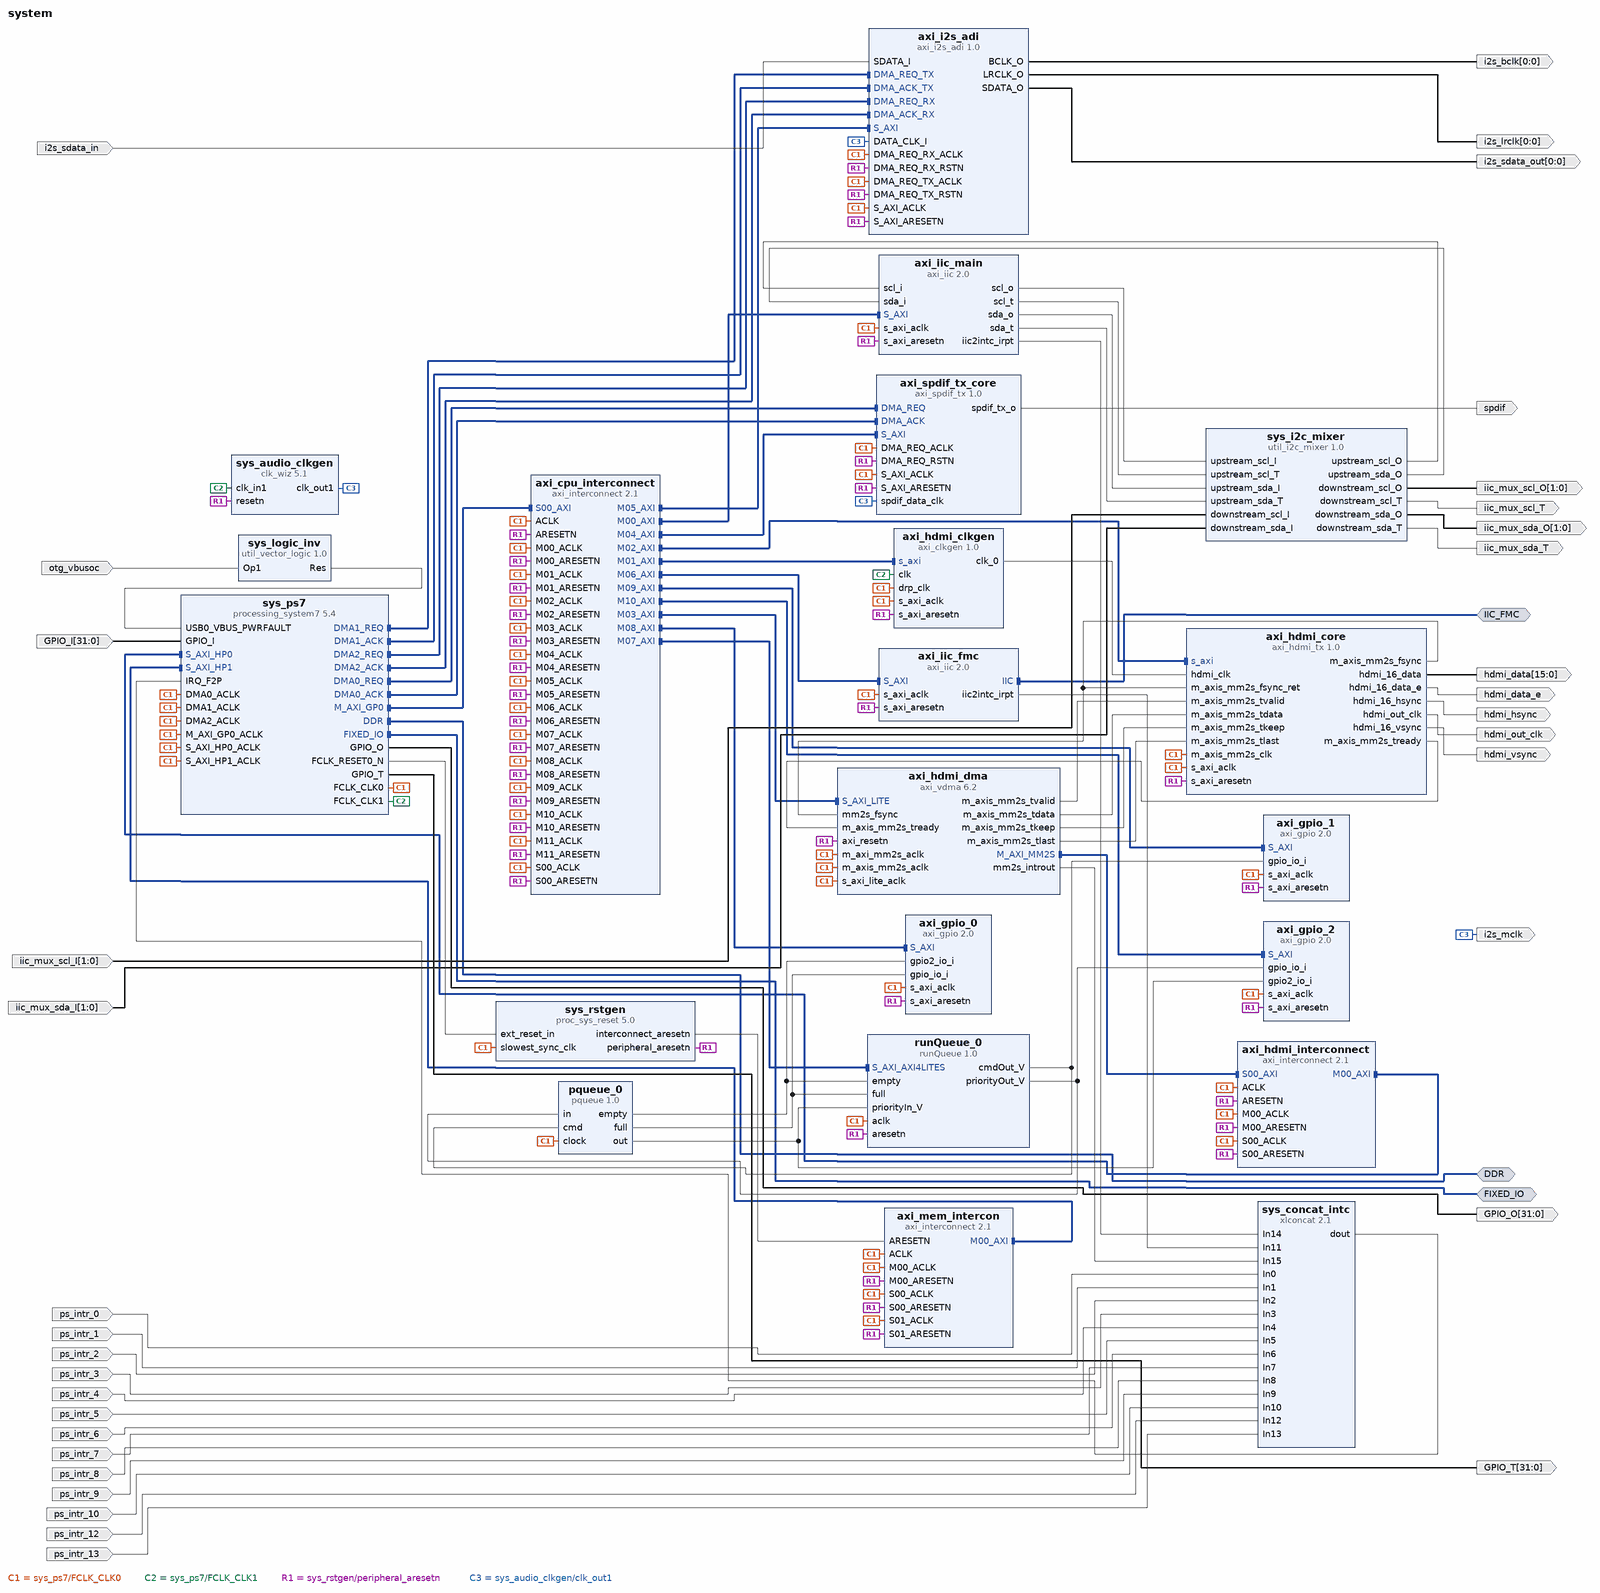
[diagram p0: block diagram of the top level]
# Vivado block design system, Vivado 2014.2
create_bd_design system

create_bd_intf_port -mode Master -vlnv xilinx.com:interface:ddrx_rtl:1.0 DDR
create_bd_intf_port -mode Master -vlnv xilinx.com:display_processing_system7:fixedio_rtl:1.0 FIXED_IO
create_bd_intf_port -mode Master -vlnv xilinx.com:interface:iic_rtl:1.0 IIC_FMC
create_bd_port -dir I -from 31 -to 0 GPIO_I
create_bd_port -dir O -from 31 -to 0 GPIO_O
create_bd_port -dir O -from 31 -to 0 GPIO_T
create_bd_port -dir I -from 1 -to 0 iic_mux_scl_I
create_bd_port -dir O -from 1 -to 0 iic_mux_scl_O
create_bd_port -dir O iic_mux_scl_T
create_bd_port -dir I -from 1 -to 0 iic_mux_sda_I
create_bd_port -dir O -from 1 -to 0 iic_mux_sda_O
create_bd_port -dir O iic_mux_sda_T
create_bd_port -dir I otg_vbusoc
create_bd_port -dir O hdmi_out_clk
create_bd_port -dir O hdmi_hsync
create_bd_port -dir O hdmi_vsync
create_bd_port -dir O hdmi_data_e
create_bd_port -dir O -from 15 -to 0 hdmi_data
create_bd_port -dir O -type clk i2s_mclk
create_bd_port -dir O spdif
create_bd_port -dir O -from 0 -to 0 i2s_bclk
create_bd_port -dir O -from 0 -to 0 i2s_lrclk
create_bd_port -dir O -from 0 -to 0 i2s_sdata_out
create_bd_port -dir I i2s_sdata_in
create_bd_port -dir I ps_intr_0
create_bd_port -dir I ps_intr_1
create_bd_port -dir I ps_intr_2
create_bd_port -dir I ps_intr_3
create_bd_port -dir I ps_intr_4
create_bd_port -dir I ps_intr_5
create_bd_port -dir I ps_intr_6
create_bd_port -dir I ps_intr_7
create_bd_port -dir I ps_intr_8
create_bd_port -dir I ps_intr_9
create_bd_port -dir I ps_intr_10
create_bd_port -dir I ps_intr_12
create_bd_port -dir I ps_intr_13

create_bd_cell -type ip -vlnv xilinx.com:ip:processing_system7:5.4 sys_ps7
set_property -dict [list \
  CONFIG.PCW_FPGA0_PERIPHERAL_FREQMHZ 100.0 \
  CONFIG.PCW_FPGA1_PERIPHERAL_FREQMHZ 200.0 \
  CONFIG.PCW_USE_S_AXI_HP0 1 \
  CONFIG.PCW_USE_S_AXI_HP1 1 \
  CONFIG.PCW_USE_DMA0 1 \
  CONFIG.PCW_USE_DMA1 1 \
  CONFIG.PCW_USE_DMA2 1 \
  CONFIG.PCW_USE_FABRIC_INTERRUPT 1 \
  CONFIG.PCW_EN_CLK1_PORT 1 \
  CONFIG.PCW_EN_RST1_PORT 1 \
  CONFIG.PCW_IRQ_F2P_INTR 1 \
  CONFIG.PCW_IRQ_F2P_MODE REVERSE \
  CONFIG.PCW_IMPORT_BOARD_PRESET ZedBoard \
  CONFIG.PCW_GPIO_EMIO_GPIO_ENABLE 1 \
  CONFIG.PCW_GPIO_EMIO_GPIO_IO 32 \
] [get_bd_cells sys_ps7]
# 1 more settings of sys_ps7 are not shown: defaults, MIO pin electricals, DDR timing, and values the tool derives
create_bd_cell -type ip -vlnv xilinx.com:ip:axi_iic:2.0 axi_iic_main
set_property -dict {CONFIG.USE_BOARD_FLOW true} [get_bd_cells axi_iic_main]
create_bd_cell -type ip -vlnv analog.com:user:util_i2c_mixer:1.0 sys_i2c_mixer
create_bd_cell -type ip -vlnv xilinx.com:ip:xlconcat:2.1 sys_concat_intc
set_property -dict {CONFIG.NUM_PORTS 16} [get_bd_cells sys_concat_intc]
create_bd_cell -type ip -vlnv xilinx.com:ip:axi_interconnect:2.1 axi_cpu_interconnect
set_property -dict {CONFIG.NUM_MI 12 CONFIG.STRATEGY 1} [get_bd_cells axi_cpu_interconnect]
create_bd_cell -type ip -vlnv xilinx.com:ip:proc_sys_reset:5.0 sys_rstgen
set_property -dict {CONFIG.C_EXT_RST_WIDTH 1} [get_bd_cells sys_rstgen]
create_bd_cell -type ip -vlnv xilinx.com:ip:util_vector_logic:1.0 sys_logic_inv
set_property -dict {CONFIG.C_SIZE 1 CONFIG.C_OPERATION not} [get_bd_cells sys_logic_inv]
create_bd_cell -type ip -vlnv analog.com:user:axi_clkgen:1.0 axi_hdmi_clkgen
create_bd_cell -type ip -vlnv analog.com:user:axi_hdmi_tx:1.0 axi_hdmi_core
create_bd_cell -type ip -vlnv xilinx.com:ip:axi_vdma:6.2 axi_hdmi_dma
set_property -dict [list \
  CONFIG.c_m_axis_mm2s_tdata_width 64 \
  CONFIG.c_use_mm2s_fsync 1 \
  CONFIG.c_include_s2mm 0 \
] [get_bd_cells axi_hdmi_dma]
create_bd_cell -type ip -vlnv xilinx.com:ip:clk_wiz:5.1 sys_audio_clkgen
set_property -dict [list \
  CONFIG.PRIM_IN_FREQ 200.000 \
  CONFIG.CLKOUT1_REQUESTED_OUT_FREQ 12.288 \
  CONFIG.USE_LOCKED false \
  CONFIG.USE_RESET true \
  CONFIG.RESET_TYPE ACTIVE_LOW \
] [get_bd_cells sys_audio_clkgen]
create_bd_cell -type ip -vlnv analog.com:user:axi_spdif_tx:1.0 axi_spdif_tx_core
set_property -dict {CONFIG.C_DMA_TYPE 1 CONFIG.C_S_AXI_ADDR_WIDTH 16} [get_bd_cells axi_spdif_tx_core]
create_bd_cell -type ip -vlnv analog.com:user:axi_i2s_adi:1.0 axi_i2s_adi
set_property -dict {CONFIG.C_DMA_TYPE 1 CONFIG.C_S_AXI_ADDR_WIDTH 16} [get_bd_cells axi_i2s_adi]
create_bd_cell -type ip -vlnv xilinx.com:ip:axi_iic:2.0 axi_iic_fmc
create_bd_cell -type ip -vlnv xilinx.com:ip:axi_interconnect:2.1 axi_hdmi_interconnect
set_property -dict {CONFIG.NUM_SI 1 CONFIG.NUM_MI 1} [get_bd_cells axi_hdmi_interconnect]
create_bd_cell -type ip -vlnv xilinx.com:ip:axi_interconnect:2.1 axi_mem_intercon
set_property -dict {CONFIG.NUM_SI 2 CONFIG.NUM_MI 1} [get_bd_cells axi_mem_intercon]
create_bd_cell -type ip -vlnv xilinx.com:ip:axi_gpio:2.0 axi_gpio_0
set_property -dict [list \
  CONFIG.C_GPIO_WIDTH 1 \
  CONFIG.C_GPIO2_WIDTH 1 \
  CONFIG.C_IS_DUAL 1 \
  CONFIG.C_ALL_INPUTS 1 \
  CONFIG.C_ALL_INPUTS_2 1 \
] [get_bd_cells axi_gpio_0]
create_bd_cell -type ip -vlnv ngn.cs.colorado.edu:user:pqueue:1.0 pqueue_0
set_property -dict {CONFIG.N 200 CONFIG.MSB 7} [get_bd_cells pqueue_0]
create_bd_cell -type ip -vlnv xilinx.com:ip:axi_gpio:2.0 axi_gpio_1
set_property -dict {CONFIG.C_GPIO_WIDTH 2 CONFIG.C_IS_DUAL 0 CONFIG.C_ALL_INPUTS 1} [get_bd_cells axi_gpio_1]
create_bd_cell -type ip -vlnv xilinx.com:ip:axi_gpio:2.0 axi_gpio_2
set_property -dict [list \
  CONFIG.C_GPIO_WIDTH 4 \
  CONFIG.C_GPIO2_WIDTH 4 \
  CONFIG.C_IS_DUAL 1 \
  CONFIG.C_ALL_INPUTS 1 \
  CONFIG.C_ALL_INPUTS_2 1 \
] [get_bd_cells axi_gpio_2]
create_bd_cell -type ip -vlnv xilinx.com:hls:runQueue:1.0 runQueue_0
set_property -dict {CONFIG.C_S_AXI_AXI4LITES_ADDR_WIDTH 8} [get_bd_cells runQueue_0]

# ---- connections ----

connect_bd_intf_net [get_bd_intf_pins axi_cpu_interconnect/S00_AXI] [get_bd_intf_pins sys_ps7/M_AXI_GP0]
connect_bd_intf_net [get_bd_intf_pins axi_cpu_interconnect/M00_AXI] [get_bd_intf_pins axi_iic_main/S_AXI]
connect_bd_intf_net [get_bd_intf_pins axi_cpu_interconnect/M01_AXI] [get_bd_intf_pins axi_hdmi_clkgen/s_axi]
connect_bd_intf_net [get_bd_intf_pins axi_cpu_interconnect/M02_AXI] [get_bd_intf_pins axi_hdmi_core/s_axi]
connect_bd_intf_net [get_bd_intf_pins axi_cpu_interconnect/M03_AXI] [get_bd_intf_pins axi_hdmi_dma/S_AXI_LITE]
connect_bd_intf_net [get_bd_intf_pins axi_cpu_interconnect/M04_AXI] [get_bd_intf_pins axi_spdif_tx_core/S_AXI]
connect_bd_intf_net -intf_net axi_spdif_dma_req_tx [get_bd_intf_pins sys_ps7/DMA0_REQ] [get_bd_intf_pins axi_spdif_tx_core/DMA_REQ]
connect_bd_intf_net -intf_net axi_spdif_dma_ack_tx [get_bd_intf_pins sys_ps7/DMA0_ACK] [get_bd_intf_pins axi_spdif_tx_core/DMA_ACK]
connect_bd_intf_net [get_bd_intf_pins axi_cpu_interconnect/M05_AXI] [get_bd_intf_pins axi_i2s_adi/S_AXI]
connect_bd_intf_net [get_bd_intf_pins sys_ps7/DMA1_REQ] [get_bd_intf_pins axi_i2s_adi/DMA_REQ_TX]
connect_bd_intf_net [get_bd_intf_pins sys_ps7/DMA1_ACK] [get_bd_intf_pins axi_i2s_adi/DMA_ACK_TX]
connect_bd_intf_net [get_bd_intf_pins sys_ps7/DMA2_REQ] [get_bd_intf_pins axi_i2s_adi/DMA_REQ_RX]
connect_bd_intf_net [get_bd_intf_pins sys_ps7/DMA2_ACK] [get_bd_intf_pins axi_i2s_adi/DMA_ACK_RX]
connect_bd_intf_net [get_bd_intf_pins axi_cpu_interconnect/M06_AXI] [get_bd_intf_pins axi_iic_fmc/S_AXI]
connect_bd_intf_net [get_bd_intf_pins axi_hdmi_interconnect/S00_AXI] [get_bd_intf_pins axi_hdmi_dma/M_AXI_MM2S]
connect_bd_intf_net [get_bd_intf_pins axi_hdmi_interconnect/M00_AXI] [get_bd_intf_pins sys_ps7/S_AXI_HP0]
connect_bd_intf_net [get_bd_intf_pins axi_mem_intercon/M00_AXI] [get_bd_intf_pins sys_ps7/S_AXI_HP1]
connect_bd_intf_net [get_bd_intf_pins axi_cpu_interconnect/M07_AXI] [get_bd_intf_pins runQueue_0/S_AXI_AXI4LITES]
connect_bd_intf_net [get_bd_intf_pins axi_cpu_interconnect/M08_AXI] [get_bd_intf_pins axi_gpio_0/S_AXI]
connect_bd_intf_net [get_bd_intf_pins axi_cpu_interconnect/M09_AXI] [get_bd_intf_pins axi_gpio_1/S_AXI]
connect_bd_intf_net [get_bd_intf_pins axi_cpu_interconnect/M10_AXI] [get_bd_intf_pins axi_gpio_2/S_AXI]
connect_bd_intf_net [get_bd_intf_ports DDR] [get_bd_intf_pins sys_ps7/DDR]
connect_bd_intf_net [get_bd_intf_ports FIXED_IO] [get_bd_intf_pins sys_ps7/FIXED_IO]
connect_bd_intf_net [get_bd_intf_ports IIC_FMC] [get_bd_intf_pins axi_iic_fmc/IIC]
connect_bd_net -net sys_100m_clk [get_bd_pins sys_ps7/FCLK_CLK0] \
  [get_bd_pins sys_rstgen/slowest_sync_clk] [get_bd_pins sys_ps7/M_AXI_GP0_ACLK] [get_bd_pins axi_cpu_interconnect/ACLK] \
  [get_bd_pins axi_cpu_interconnect/S00_ACLK] [get_bd_pins axi_cpu_interconnect/M00_ACLK] \
  [get_bd_pins axi_iic_main/s_axi_aclk] [get_bd_pins axi_cpu_interconnect/M01_ACLK] \
  [get_bd_pins axi_cpu_interconnect/M02_ACLK] [get_bd_pins axi_cpu_interconnect/M03_ACLK] \
  [get_bd_pins axi_hdmi_clkgen/s_axi_aclk] [get_bd_pins axi_hdmi_clkgen/drp_clk] [get_bd_pins axi_hdmi_core/s_axi_aclk] \
  [get_bd_pins axi_hdmi_core/m_axis_mm2s_clk] [get_bd_pins axi_hdmi_dma/s_axi_lite_aclk] \
  [get_bd_pins axi_hdmi_dma/m_axi_mm2s_aclk] [get_bd_pins axi_hdmi_dma/m_axis_mm2s_aclk] [get_bd_pins sys_ps7/S_AXI_HP0_ACLK] \
  [get_bd_pins axi_cpu_interconnect/M04_ACLK] [get_bd_pins axi_spdif_tx_core/S_AXI_ACLK] \
  [get_bd_pins axi_spdif_tx_core/DMA_REQ_ACLK] [get_bd_pins sys_ps7/DMA0_ACLK] [get_bd_pins axi_cpu_interconnect/M05_ACLK] \
  [get_bd_pins axi_i2s_adi/S_AXI_ACLK] [get_bd_pins axi_i2s_adi/DMA_REQ_RX_ACLK] [get_bd_pins axi_i2s_adi/DMA_REQ_TX_ACLK] \
  [get_bd_pins sys_ps7/DMA1_ACLK] [get_bd_pins sys_ps7/DMA2_ACLK] [get_bd_pins axi_cpu_interconnect/M06_ACLK] \
  [get_bd_pins axi_iic_fmc/s_axi_aclk] [get_bd_pins axi_cpu_interconnect/M07_ACLK] \
  [get_bd_pins axi_cpu_interconnect/M08_ACLK] [get_bd_pins sys_ps7/S_AXI_HP1_ACLK] \
  [get_bd_pins axi_cpu_interconnect/M09_ACLK] [get_bd_pins axi_cpu_interconnect/M10_ACLK] \
  [get_bd_pins axi_cpu_interconnect/M11_ACLK] [get_bd_pins axi_hdmi_interconnect/ACLK] \
  [get_bd_pins axi_hdmi_interconnect/M00_ACLK] [get_bd_pins axi_hdmi_interconnect/S00_ACLK] \
  [get_bd_pins axi_mem_intercon/S00_ACLK] [get_bd_pins axi_mem_intercon/ACLK] [get_bd_pins axi_mem_intercon/M00_ACLK] \
  [get_bd_pins axi_mem_intercon/S01_ACLK] [get_bd_pins axi_gpio_0/s_axi_aclk] [get_bd_pins pqueue_0/clock] \
  [get_bd_pins axi_gpio_1/s_axi_aclk] [get_bd_pins axi_gpio_2/s_axi_aclk] [get_bd_pins runQueue_0/aclk]
connect_bd_net -net sys_200m_clk [get_bd_pins sys_ps7/FCLK_CLK1] [get_bd_pins axi_hdmi_clkgen/clk] [get_bd_pins sys_audio_clkgen/clk_in1]
connect_bd_net -net sys_aux_reset [get_bd_pins sys_ps7/FCLK_RESET0_N] [get_bd_pins sys_rstgen/ext_reset_in]
connect_bd_net -net sys_100m_resetn [get_bd_pins sys_rstgen/peripheral_aresetn] \
  [get_bd_pins axi_cpu_interconnect/ARESETN] [get_bd_pins axi_cpu_interconnect/S00_ARESETN] \
  [get_bd_pins axi_cpu_interconnect/M00_ARESETN] [get_bd_pins axi_iic_main/s_axi_aresetn] \
  [get_bd_pins axi_cpu_interconnect/M01_ARESETN] [get_bd_pins axi_cpu_interconnect/M02_ARESETN] \
  [get_bd_pins axi_cpu_interconnect/M03_ARESETN] [get_bd_pins axi_hdmi_clkgen/s_axi_aresetn] \
  [get_bd_pins axi_hdmi_core/s_axi_aresetn] [get_bd_pins axi_hdmi_dma/axi_resetn] \
  [get_bd_pins axi_cpu_interconnect/M04_ARESETN] [get_bd_pins axi_spdif_tx_core/S_AXI_ARESETN] \
  [get_bd_pins axi_spdif_tx_core/DMA_REQ_RSTN] [get_bd_pins sys_audio_clkgen/resetn] \
  [get_bd_pins axi_cpu_interconnect/M05_ARESETN] [get_bd_pins axi_i2s_adi/S_AXI_ARESETN] \
  [get_bd_pins axi_i2s_adi/DMA_REQ_RX_RSTN] [get_bd_pins axi_i2s_adi/DMA_REQ_TX_RSTN] \
  [get_bd_pins axi_cpu_interconnect/M06_ARESETN] [get_bd_pins axi_iic_fmc/s_axi_aresetn] \
  [get_bd_pins axi_cpu_interconnect/M07_ARESETN] [get_bd_pins axi_cpu_interconnect/M08_ARESETN] \
  [get_bd_pins axi_cpu_interconnect/M09_ARESETN] [get_bd_pins axi_cpu_interconnect/M10_ARESETN] \
  [get_bd_pins axi_cpu_interconnect/M11_ARESETN] [get_bd_pins axi_hdmi_interconnect/ARESETN] \
  [get_bd_pins axi_hdmi_interconnect/M00_ARESETN] [get_bd_pins axi_hdmi_interconnect/S00_ARESETN] \
  [get_bd_pins axi_mem_intercon/S00_ARESETN] [get_bd_pins axi_mem_intercon/M00_ARESETN] \
  [get_bd_pins axi_mem_intercon/S01_ARESETN] [get_bd_pins axi_gpio_0/s_axi_aresetn] [get_bd_pins axi_gpio_1/s_axi_aresetn] \
  [get_bd_pins axi_gpio_2/s_axi_aresetn] [get_bd_pins runQueue_0/aresetn]
connect_bd_net -net sys_ps7_GPIO_I [get_bd_ports GPIO_I] [get_bd_pins sys_ps7/GPIO_I]
connect_bd_net [get_bd_pins sys_ps7/GPIO_O] [get_bd_ports GPIO_O]
connect_bd_net [get_bd_pins sys_ps7/GPIO_T] [get_bd_ports GPIO_T]
connect_bd_net -net axi_iic_main_scl_i [get_bd_pins sys_i2c_mixer/upstream_scl_O] [get_bd_pins axi_iic_main/scl_i]
connect_bd_net [get_bd_pins axi_iic_main/scl_o] [get_bd_pins sys_i2c_mixer/upstream_scl_I]
connect_bd_net [get_bd_pins axi_iic_main/scl_t] [get_bd_pins sys_i2c_mixer/upstream_scl_T]
connect_bd_net -net axi_iic_main_sda_i [get_bd_pins sys_i2c_mixer/upstream_sda_O] [get_bd_pins axi_iic_main/sda_i]
connect_bd_net [get_bd_pins axi_iic_main/sda_o] [get_bd_pins sys_i2c_mixer/upstream_sda_I]
connect_bd_net [get_bd_pins axi_iic_main/sda_t] [get_bd_pins sys_i2c_mixer/upstream_sda_T]
connect_bd_net -net sys_i2c_mixer_downstream_scl_i [get_bd_ports iic_mux_scl_I] [get_bd_pins sys_i2c_mixer/downstream_scl_I]
connect_bd_net [get_bd_pins sys_i2c_mixer/downstream_scl_O] [get_bd_ports iic_mux_scl_O]
connect_bd_net [get_bd_pins sys_i2c_mixer/downstream_scl_T] [get_bd_ports iic_mux_scl_T]
connect_bd_net -net sys_i2c_mixer_downstream_sda_i [get_bd_ports iic_mux_sda_I] [get_bd_pins sys_i2c_mixer/downstream_sda_I]
connect_bd_net [get_bd_pins sys_i2c_mixer/downstream_sda_O] [get_bd_ports iic_mux_sda_O]
connect_bd_net [get_bd_pins sys_i2c_mixer/downstream_sda_T] [get_bd_ports iic_mux_sda_T]
connect_bd_net -net sys_logic_inv_o [get_bd_pins sys_logic_inv/Res] [get_bd_pins sys_ps7/USB0_VBUS_PWRFAULT]
connect_bd_net -net sys_logic_inv_i [get_bd_ports otg_vbusoc] [get_bd_pins sys_logic_inv/Op1]
connect_bd_net -net axi_hdmi_tx_core_hdmi_clk [get_bd_pins axi_hdmi_clkgen/clk_0] [get_bd_pins axi_hdmi_core/hdmi_clk]
connect_bd_net -net axi_hdmi_tx_core_hdmi_out_clk [get_bd_pins axi_hdmi_core/hdmi_out_clk] [get_bd_ports hdmi_out_clk]
connect_bd_net -net axi_hdmi_tx_core_hdmi_hsync [get_bd_pins axi_hdmi_core/hdmi_16_hsync] [get_bd_ports hdmi_hsync]
connect_bd_net -net axi_hdmi_tx_core_hdmi_vsync [get_bd_pins axi_hdmi_core/hdmi_16_vsync] [get_bd_ports hdmi_vsync]
connect_bd_net -net axi_hdmi_tx_core_hdmi_data_e [get_bd_pins axi_hdmi_core/hdmi_16_data_e] [get_bd_ports hdmi_data_e]
connect_bd_net -net axi_hdmi_tx_core_hdmi_data [get_bd_pins axi_hdmi_core/hdmi_16_data] [get_bd_ports hdmi_data]
connect_bd_net -net axi_hdmi_tx_core_mm2s_tvalid [get_bd_pins axi_hdmi_dma/m_axis_mm2s_tvalid] [get_bd_pins axi_hdmi_core/m_axis_mm2s_tvalid]
connect_bd_net -net axi_hdmi_tx_core_mm2s_tdata [get_bd_pins axi_hdmi_dma/m_axis_mm2s_tdata] [get_bd_pins axi_hdmi_core/m_axis_mm2s_tdata]
connect_bd_net -net axi_hdmi_tx_core_mm2s_tkeep [get_bd_pins axi_hdmi_dma/m_axis_mm2s_tkeep] [get_bd_pins axi_hdmi_core/m_axis_mm2s_tkeep]
connect_bd_net -net axi_hdmi_tx_core_mm2s_tlast [get_bd_pins axi_hdmi_dma/m_axis_mm2s_tlast] [get_bd_pins axi_hdmi_core/m_axis_mm2s_tlast]
connect_bd_net -net axi_hdmi_tx_core_mm2s_tready [get_bd_pins axi_hdmi_core/m_axis_mm2s_tready] [get_bd_pins axi_hdmi_dma/m_axis_mm2s_tready]
connect_bd_net -net axi_hdmi_tx_core_mm2s_fsync [get_bd_pins axi_hdmi_core/m_axis_mm2s_fsync] \
  [get_bd_pins axi_hdmi_dma/mm2s_fsync] [get_bd_pins axi_hdmi_core/m_axis_mm2s_fsync_ret]
connect_bd_net -net sys_audio_clkgen_clk [get_bd_pins sys_audio_clkgen/clk_out1] \
  [get_bd_ports i2s_mclk] [get_bd_pins axi_spdif_tx_core/spdif_data_clk] [get_bd_pins axi_i2s_adi/DATA_CLK_I]
connect_bd_net -net spdif_s [get_bd_pins axi_spdif_tx_core/spdif_tx_o] [get_bd_ports spdif]
connect_bd_net -net i2s_bclk_s [get_bd_pins axi_i2s_adi/BCLK_O] [get_bd_ports i2s_bclk]
connect_bd_net -net i2s_lrclk_s [get_bd_pins axi_i2s_adi/LRCLK_O] [get_bd_ports i2s_lrclk]
connect_bd_net -net i2s_sdata_out_s [get_bd_pins axi_i2s_adi/SDATA_O] [get_bd_ports i2s_sdata_out]
connect_bd_net -net i2s_sdata_in_s [get_bd_ports i2s_sdata_in] [get_bd_pins axi_i2s_adi/SDATA_I]
connect_bd_net [get_bd_pins sys_concat_intc/dout] [get_bd_pins sys_ps7/IRQ_F2P]
connect_bd_net [get_bd_pins axi_hdmi_dma/mm2s_introut] [get_bd_pins sys_concat_intc/In15]
connect_bd_net [get_bd_pins axi_iic_main/iic2intc_irpt] [get_bd_pins sys_concat_intc/In14]
connect_bd_net -net ps_intr_0_s [get_bd_ports ps_intr_0] [get_bd_pins sys_concat_intc/In0]
connect_bd_net -net ps_intr_1_s [get_bd_ports ps_intr_1] [get_bd_pins sys_concat_intc/In1]
connect_bd_net -net ps_intr_2_s [get_bd_ports ps_intr_2] [get_bd_pins sys_concat_intc/In2]
connect_bd_net -net ps_intr_3_s [get_bd_ports ps_intr_3] [get_bd_pins sys_concat_intc/In3]
connect_bd_net -net ps_intr_4_s [get_bd_ports ps_intr_4] [get_bd_pins sys_concat_intc/In4]
connect_bd_net -net ps_intr_5_s [get_bd_ports ps_intr_5] [get_bd_pins sys_concat_intc/In5]
connect_bd_net -net ps_intr_6_s [get_bd_ports ps_intr_6] [get_bd_pins sys_concat_intc/In6]
connect_bd_net -net ps_intr_7_s [get_bd_ports ps_intr_7] [get_bd_pins sys_concat_intc/In7]
connect_bd_net -net ps_intr_8_s [get_bd_ports ps_intr_8] [get_bd_pins sys_concat_intc/In8]
connect_bd_net -net ps_intr_9_s [get_bd_ports ps_intr_9] [get_bd_pins sys_concat_intc/In9]
connect_bd_net -net ps_intr_10_s [get_bd_ports ps_intr_10] [get_bd_pins sys_concat_intc/In10]
connect_bd_net -net ps_intr_12_s [get_bd_ports ps_intr_12] [get_bd_pins sys_concat_intc/In12]
connect_bd_net -net ps_intr_13_s [get_bd_ports ps_intr_13] [get_bd_pins sys_concat_intc/In13]
connect_bd_net -net axi_iic_fmc_intr [get_bd_pins axi_iic_fmc/iic2intc_irpt] [get_bd_pins sys_concat_intc/In11]
connect_bd_net [get_bd_pins sys_rstgen/interconnect_aresetn] [get_bd_pins axi_mem_intercon/ARESETN]
connect_bd_net -net pqueue_1_empty [get_bd_pins pqueue_0/empty] [get_bd_pins axi_gpio_0/gpio2_io_i] [get_bd_pins runQueue_0/empty]
connect_bd_net -net pqueue_1_full [get_bd_pins pqueue_0/full] [get_bd_pins axi_gpio_0/gpio_io_i] [get_bd_pins runQueue_0/full]
connect_bd_net [get_bd_pins runQueue_0/priorityOut_V] [get_bd_pins pqueue_0/in] [get_bd_pins axi_gpio_2/gpio_io_i]
connect_bd_net [get_bd_pins runQueue_0/cmdOut_V] [get_bd_pins pqueue_0/cmd] [get_bd_pins axi_gpio_1/gpio_io_i]
connect_bd_net [get_bd_pins pqueue_0/out] [get_bd_pins axi_gpio_2/gpio2_io_i] [get_bd_pins runQueue_0/priorityIn_V]

# ---- address map ----
assign_bd_address -offset 0x00000000 -range 512M -target_address_space [get_bd_addr_spaces axi_hdmi_dma/Data_MM2S] [get_bd_addr_segs sys_ps7/S_AXI_HP0/HP0_DDR_LOWOCM]
assign_bd_address -offset 0x41200000 -range 64K -target_address_space [get_bd_addr_spaces sys_ps7/Data] [get_bd_addr_segs axi_gpio_0/S_AXI/Reg]
assign_bd_address -offset 0x41210000 -range 64K -target_address_space [get_bd_addr_spaces sys_ps7/Data] [get_bd_addr_segs axi_gpio_1/S_AXI/Reg]
assign_bd_address -offset 0x41220000 -range 64K -target_address_space [get_bd_addr_spaces sys_ps7/Data] [get_bd_addr_segs axi_gpio_2/S_AXI/Reg]
assign_bd_address -offset 0x41600000 -range 64K -target_address_space [get_bd_addr_spaces sys_ps7/Data] [get_bd_addr_segs axi_iic_main/S_AXI/Reg]
assign_bd_address -offset 0x41620000 -range 64K -target_address_space [get_bd_addr_spaces sys_ps7/Data] [get_bd_addr_segs axi_iic_fmc/S_AXI/Reg]
assign_bd_address -offset 0x43000000 -range 64K -target_address_space [get_bd_addr_spaces sys_ps7/Data] [get_bd_addr_segs axi_hdmi_dma/S_AXI_LITE/Reg]
assign_bd_address -offset 0x43C00000 -range 64K -target_address_space [get_bd_addr_spaces sys_ps7/Data] [get_bd_addr_segs runQueue_0/S_AXI_AXI4LITES/Reg]
assign_bd_address -offset 0x70E00000 -range 64K -target_address_space [get_bd_addr_spaces sys_ps7/Data] [get_bd_addr_segs axi_hdmi_core/s_axi/axi_lite]
assign_bd_address -offset 0x75C00000 -range 64K -target_address_space [get_bd_addr_spaces sys_ps7/Data] [get_bd_addr_segs axi_spdif_tx_core/S_AXI/reg0]
assign_bd_address -offset 0x77600000 -range 64K -target_address_space [get_bd_addr_spaces sys_ps7/Data] [get_bd_addr_segs axi_i2s_adi/S_AXI/reg0]
assign_bd_address -offset 0x79000000 -range 64K -target_address_space [get_bd_addr_spaces sys_ps7/Data] [get_bd_addr_segs axi_hdmi_clkgen/s_axi/axi_lite]

validate_bd_design
save_bd_design
